# EAGLE design LED_TEST (EAGLE 7.7.0)
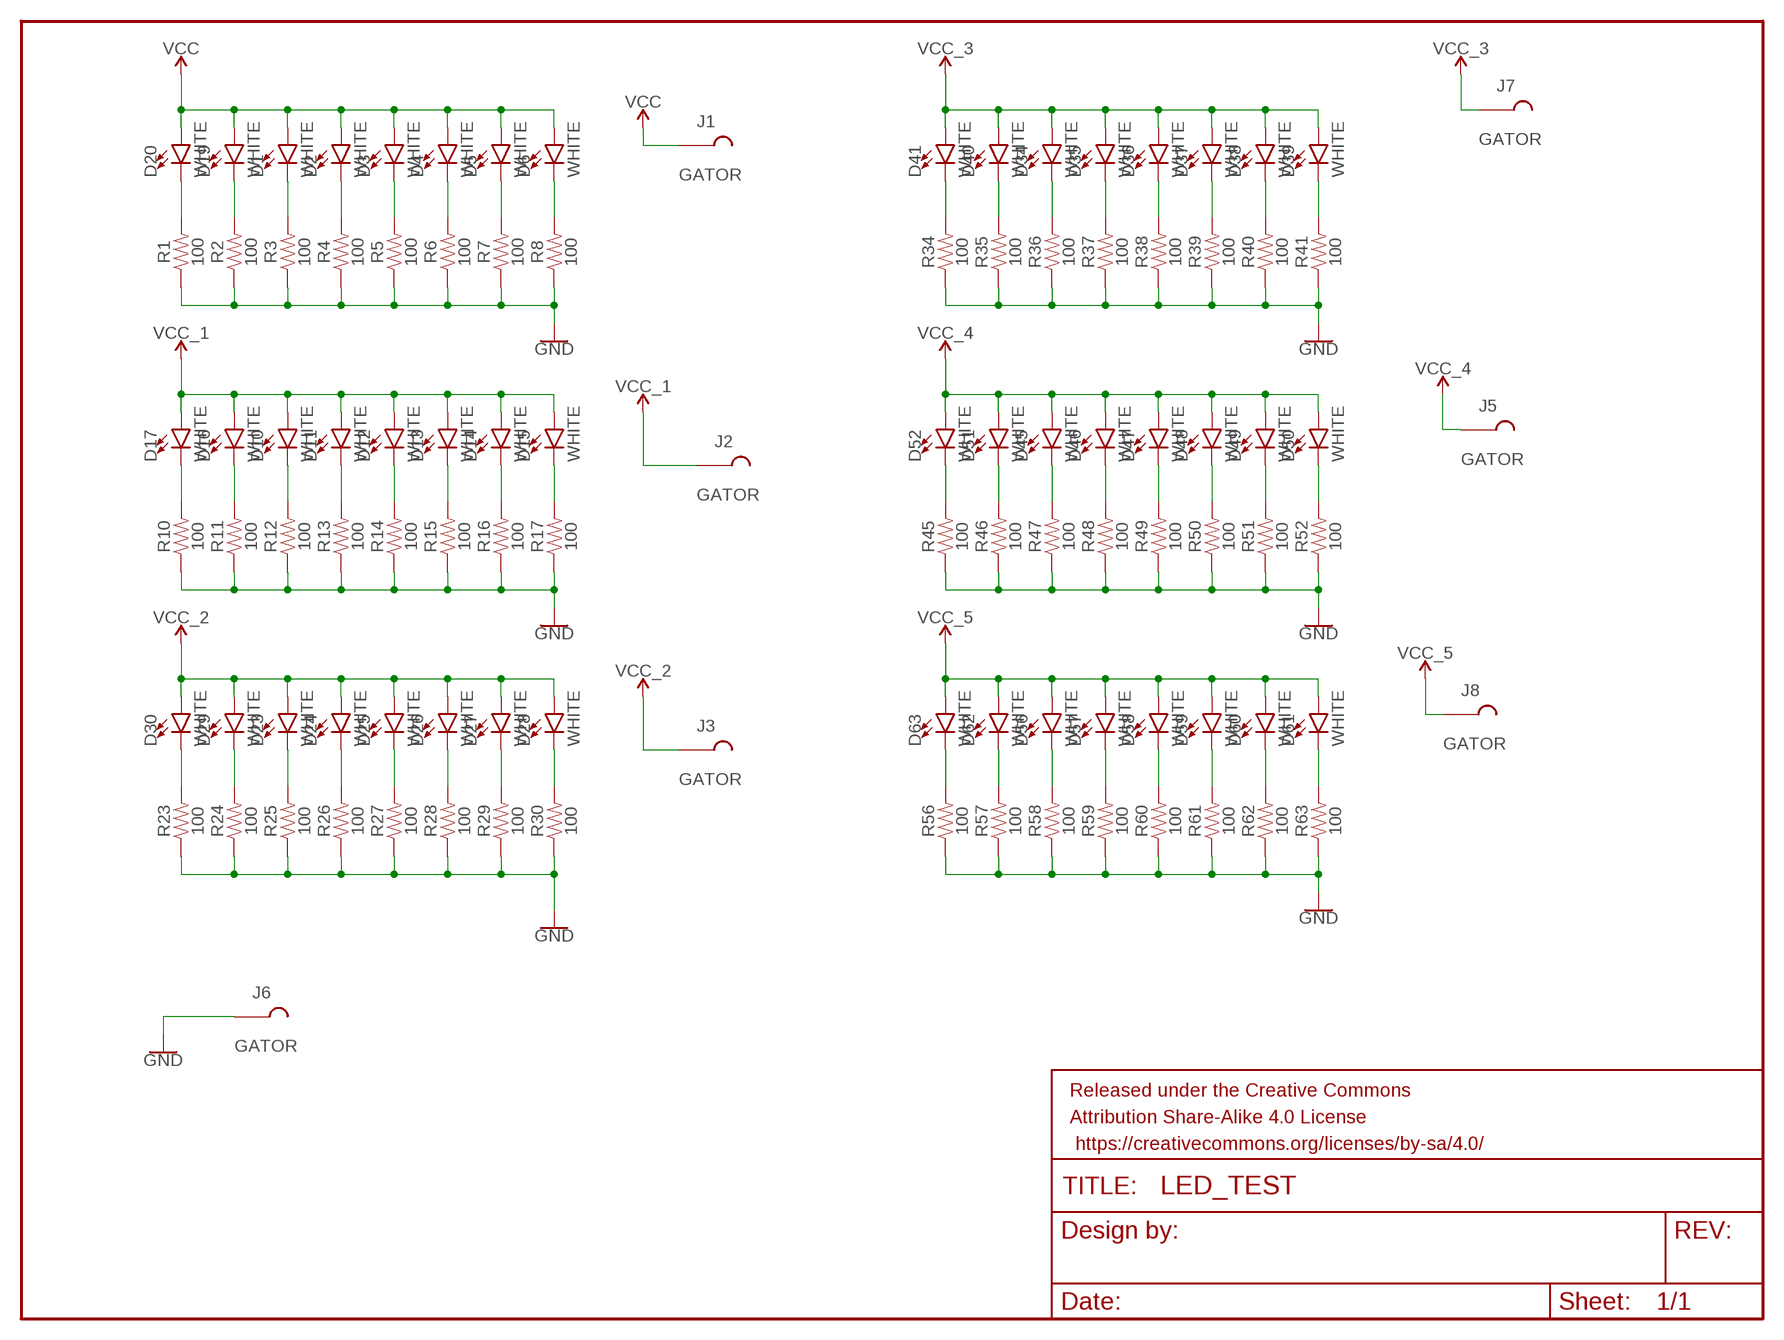
[diagram p0: schematic, sheet 1]

## Parts
D1  WHITE  LED-WHITE1206  [LED-1206]
D2  WHITE  LED-WHITE1206  [LED-1206]
D3  WHITE  LED-WHITE1206  [LED-1206]
D4  WHITE  LED-WHITE1206  [LED-1206]
D5  WHITE  LED-WHITE1206  [LED-1206]
D6  WHITE  LED-WHITE1206  [LED-1206]
D10  WHITE  LED-WHITE1206  [LED-1206]
D11  WHITE  LED-WHITE1206  [LED-1206]
D12  WHITE  LED-WHITE1206  [LED-1206]
D13  WHITE  LED-WHITE1206  [LED-1206]
D14  WHITE  LED-WHITE1206  [LED-1206]
D15  WHITE  LED-WHITE1206  [LED-1206]
D16  WHITE  LED-WHITE1206  [LED-1206]
D17  WHITE  LED-WHITE1206  [LED-1206]
D19  WHITE  LED-WHITE1206  [LED-1206]
D20  WHITE  LED-WHITE1206  [LED-1206]
D23  WHITE  LED-WHITE1206  [LED-1206]
D24  WHITE  LED-WHITE1206  [LED-1206]
D25  WHITE  LED-WHITE1206  [LED-1206]
D26  WHITE  LED-WHITE1206  [LED-1206]
D27  WHITE  LED-WHITE1206  [LED-1206]
D28  WHITE  LED-WHITE1206  [LED-1206]
D29  WHITE  LED-WHITE1206  [LED-1206]
D30  WHITE  LED-WHITE1206  [LED-1206]
D34  WHITE  LED-WHITE1206  [LED-1206]
D35  WHITE  LED-WHITE1206  [LED-1206]
D36  WHITE  LED-WHITE1206  [LED-1206]
D37  WHITE  LED-WHITE1206  [LED-1206]
D38  WHITE  LED-WHITE1206  [LED-1206]
D39  WHITE  LED-WHITE1206  [LED-1206]
D40  WHITE  LED-WHITE1206  [LED-1206]
D41  WHITE  LED-WHITE1206  [LED-1206]
D45  WHITE  LED-WHITE1206  [LED-1206]
D46  WHITE  LED-WHITE1206  [LED-1206]
D47  WHITE  LED-WHITE1206  [LED-1206]
D48  WHITE  LED-WHITE1206  [LED-1206]
D49  WHITE  LED-WHITE1206  [LED-1206]
D50  WHITE  LED-WHITE1206  [LED-1206]
D51  WHITE  LED-WHITE1206  [LED-1206]
D52  WHITE  LED-WHITE1206  [LED-1206]
D56  WHITE  LED-WHITE1206  [LED-1206]
D57  WHITE  LED-WHITE1206  [LED-1206]
D58  WHITE  LED-WHITE1206  [LED-1206]
D59  WHITE  LED-WHITE1206  [LED-1206]
D60  WHITE  LED-WHITE1206  [LED-1206]
D61  WHITE  LED-WHITE1206  [LED-1206]
D62  WHITE  LED-WHITE1206  [LED-1206]
D63  WHITE  LED-WHITE1206  [LED-1206]
FRAME1  FRAME-LETTER  [CREATIVE_COMMONS]
J1  GATOR  [GATOR]
J2  GATOR  [GATOR]
J3  GATOR  [GATOR]
J5  GATOR  [GATOR]
J6  GATOR  [GATOR]
J7  GATOR  [GATOR]
J8  GATOR  [GATOR]
R1  100  100OHM-0603-1/4W-5%  [0603]
R2  100  100OHM-0603-1/4W-5%  [0603]
R3  100  100OHM-0603-1/4W-5%  [0603]
R4  100  100OHM-0603-1/4W-5%  [0603]
R5  100  100OHM-0603-1/4W-5%  [0603]
R6  100  100OHM-0603-1/4W-5%  [0603]
R7  100  100OHM-0603-1/4W-5%  [0603]
R8  100  100OHM-0603-1/4W-5%  [0603]
R10  100  100OHM-0603-1/4W-5%  [0603]
R11  100  100OHM-0603-1/4W-5%  [0603]
R12  100  100OHM-0603-1/4W-5%  [0603]
R13  100  100OHM-0603-1/4W-5%  [0603]
R14  100  100OHM-0603-1/4W-5%  [0603]
R15  100  100OHM-0603-1/4W-5%  [0603]
R16  100  100OHM-0603-1/4W-5%  [0603]
R17  100  100OHM-0603-1/4W-5%  [0603]
R23  100  100OHM-0603-1/4W-5%  [0603]
R24  100  100OHM-0603-1/4W-5%  [0603]
R25  100  100OHM-0603-1/4W-5%  [0603]
R26  100  100OHM-0603-1/4W-5%  [0603]
R27  100  100OHM-0603-1/4W-5%  [0603]
R28  100  100OHM-0603-1/4W-5%  [0603]
R29  100  100OHM-0603-1/4W-5%  [0603]
R30  100  100OHM-0603-1/4W-5%  [0603]
R34  100  100OHM-0603-1/4W-5%  [0603]
R35  100  100OHM-0603-1/4W-5%  [0603]
R36  100  100OHM-0603-1/4W-5%  [0603]
R37  100  100OHM-0603-1/4W-5%  [0603]
R38  100  100OHM-0603-1/4W-5%  [0603]
R39  100  100OHM-0603-1/4W-5%  [0603]
R40  100  100OHM-0603-1/4W-5%  [0603]
R41  100  100OHM-0603-1/4W-5%  [0603]
R45  100  100OHM-0603-1/4W-5%  [0603]
R46  100  100OHM-0603-1/4W-5%  [0603]
R47  100  100OHM-0603-1/4W-5%  [0603]
R48  100  100OHM-0603-1/4W-5%  [0603]
R49  100  100OHM-0603-1/4W-5%  [0603]
R50  100  100OHM-0603-1/4W-5%  [0603]
R51  100  100OHM-0603-1/4W-5%  [0603]
R52  100  100OHM-0603-1/4W-5%  [0603]
R56  100  100OHM-0603-1/4W-5%  [0603]
R57  100  100OHM-0603-1/4W-5%  [0603]
R58  100  100OHM-0603-1/4W-5%  [0603]
R59  100  100OHM-0603-1/4W-5%  [0603]
R60  100  100OHM-0603-1/4W-5%  [0603]
R61  100  100OHM-0603-1/4W-5%  [0603]
R62  100  100OHM-0603-1/4W-5%  [0603]
R63  100  100OHM-0603-1/4W-5%  [0603]

## Nets
GND: J6.P$1 J6.P$2 R1.1 R2.1 R3.1 R4.1 R5.1 R6.1 R7.1 R8.1 R10.1 R11.1 R12.1 R13.1 R14.1 R15.1 R16.1 R17.1 R23.1 R24.1 R25.1 R26.1 R27.1 R28.1 R29.1 R30.1 R34.1 R35.1 R36.1 R37.1 R38.1 R39.1 R40.1 R41.1 R45.1 R46.1 R47.1 R48.1 R49.1 R50.1 R51.1 R52.1 R56.1 R57.1 R58.1 R59.1 R60.1 R61.1 R62.1 R63.1
N$1: D20.C R1.2
N$2: D19.C R2.2
N$3: D1.C R3.2
N$4: D2.C R4.2
N$5: D3.C R5.2
N$6: D4.C R6.2
N$7: D5.C R7.2
N$8: D6.C R8.2
N$9: D17.C R10.2
N$10: D16.C R11.2
N$11: D10.C R12.2
N$12: D11.C R13.2
N$13: D12.C R14.2
N$14: D13.C R15.2
N$15: D14.C R16.2
N$16: D15.C R17.2
N$27: D30.C R23.2
N$28: D29.C R24.2
N$29: D23.C R25.2
N$30: D24.C R26.2
N$31: D25.C R27.2
N$32: D26.C R28.2
N$33: D27.C R29.2
N$34: D28.C R30.2
N$40: D41.C R34.2
N$41: D40.C R35.2
N$42: D34.C R36.2
N$43: D35.C R37.2
N$44: D36.C R38.2
N$45: D37.C R39.2
N$46: D38.C R40.2
N$47: D39.C R41.2
N$53: D52.C R45.2
N$54: D51.C R46.2
N$55: D45.C R47.2
N$56: D46.C R48.2
N$57: D47.C R49.2
N$58: D48.C R50.2
N$59: D49.C R51.2
N$60: D50.C R52.2
N$66: D63.C R56.2
N$67: D62.C R57.2
N$68: D56.C R58.2
N$69: D57.C R59.2
N$70: D58.C R60.2
N$71: D59.C R61.2
N$72: D60.C R62.2
N$73: D61.C R63.2
VCC: D1.A D2.A D3.A D4.A D5.A D6.A D19.A D20.A J1.P$1 J1.P$2
VCC_1: D10.A D11.A D12.A D13.A D14.A D15.A D16.A D17.A J2.P$1 J2.P$2
VCC_2: D23.A D24.A D25.A D26.A D27.A D28.A D29.A D30.A J3.P$1 J3.P$2
VCC_3: D34.A D35.A D36.A D37.A D38.A D39.A D40.A D41.A J7.P$1 J7.P$2
VCC_4: D45.A D46.A D47.A D48.A D49.A D50.A D51.A D52.A J5.P$1 J5.P$2
VCC_5: D56.A D57.A D58.A D59.A D60.A D61.A D62.A D63.A J8.P$1 J8.P$2

## Library data of the parts
D1-D6 D10-D17 D19 D20 D23-D30 D34-D41 D45-D52 D56-D63 = SparkFun-LED:LED-WHITE: White SMD LED Used in manufacturing several products at SparkFun. Packages: 0603 - Bright White SMD 0603 package[Product Link] <http://www.kingbrightusa.com/product.asp?catalog_name=LED&product_id=APT1608QWF/D> 1206 - Bright White SMD1206 package [Product Link] <http://www.kingbrightusa.com/product.asp?catalog_name=LED&product_id=APT3216QWF/D> 3014 - Super Bright SMD 3014 package [Datasheet] <http://www.lumileds.com/uploads/459/DS208-pdf> SparkFun Products: Blackberry Trackballer Breakout <https://www.sparkfun.com/products/13169> Digital SandBox <https://www.sparkfun.com/products/12651>; PROD_ID: DIO-09955
FRAME1 = SparkFun-Aesthetics:FRAME-LETTER: Schematic Frame - Letter Standard 8.5x11 US Letter frame
J1-J3 J5-J8 = TAB:GATOR
R1-R8 R10-R17 R23-R30 R34-R41 R45-R52 R56-R63 = SparkFun-Resistors:100OHM: 100Ω resistor A resistor is a passive two-terminal electrical component that implements electrical resistance as a circuit element. Resistors act to reduce current flow, and, at the same time, act to lower voltage levels within circuits. - Wikipedia; PROD_ID: RES-12438

## Board
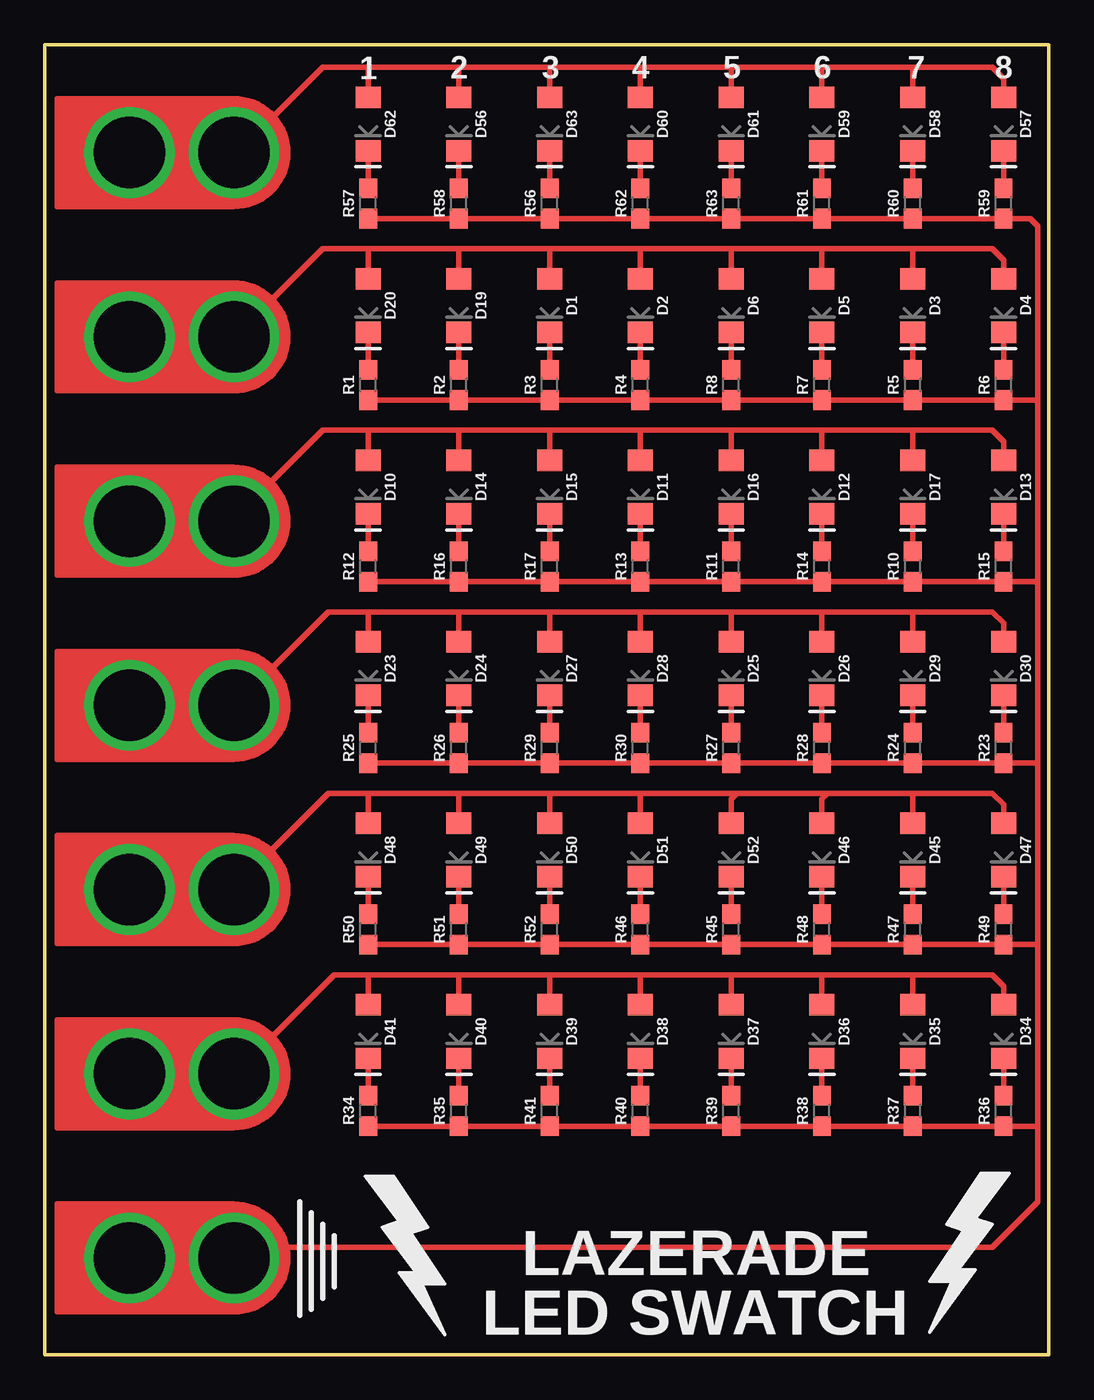
[diagram p1: board, top side]
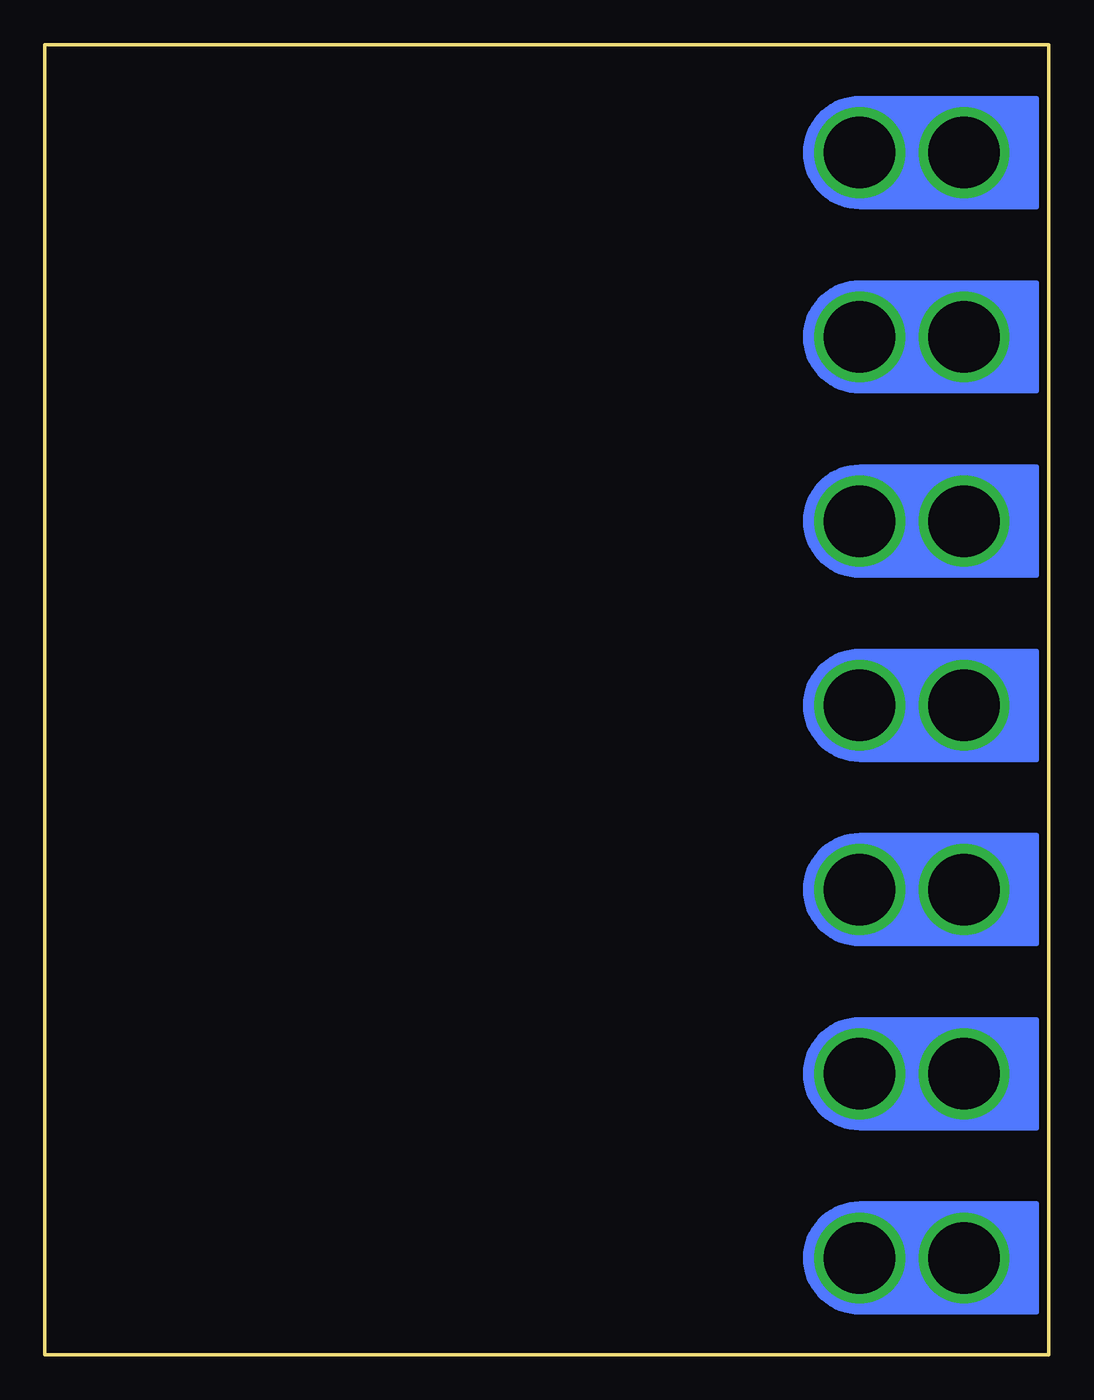
[diagram p2: board, bottom side, seen from below]

Size 56.2 x 73.34 mm. Coordinates in mm from the lower left corner, seen from the top.
Outline: 0,73.34 56.2,73.34 56.2,0 0,0 0,73.34
Copper layers (1*16): Top 0.035mm / dielectric 1.5mm / Bottom 0.035mm
Design rules "SparkFun-2-layer-STANDARD": minimum track width 10mil, minimum drill 20mil, track to track 10mil, track to pad 8mil, pad to pad 8mil, via to via 10mil, smd to smd 8mil, copper to edge 8mil, drill to drill 8mil, minimum pad ring 10mil, minimum via ring 10mil, stop-mask expansion 4mil, vias tented up to drill 25mil, thermal gap 10mil

### Footprints (pad centres in the part's own frame; a part is rotated, then mirrored left to right if it is on the bottom)
LED-1206 = smd 1.2 x 1.4: A -1.5,0; C 1.5,0
GATOR = drill 4 pad 5.08: P$1 0,-6.096; P$2 0,-0.254
0603 = smd 1.1 x 1: 1 -0.85,0; 2 0.85,0

### Placement (x,y rotation side)
D1  28.26,58.74 270 top
D2  33.34,58.74 270 top
D3  48.58,58.74 270 top
D4  53.66,58.74 270 top
D5  43.5,58.74 270 top
D6  38.42,58.74 270 top
D10  18.1,48.58 270 top
D11  33.34,48.58 270 top
D12  43.5,48.58 270 top
D13  53.66,48.58 270 top
D14  23.18,48.58 270 top
D15  28.26,48.58 270 top
D16  38.42,48.58 270 top
D17  48.58,48.58 270 top
D19  23.18,58.74 270 top
D20  18.1,58.74 270 top
D23  18.1,38.42 270 top
D24  23.18,38.42 270 top
D25  38.42,38.42 270 top
D26  43.5,38.42 270 top
D27  28.26,38.42 270 top
D28  33.34,38.42 270 top
D29  48.58,38.42 270 top
D30  53.66,38.42 270 top
D34  53.66,18.1 270 top
D35  48.58,18.1 270 top
D36  43.5,18.1 270 top
D37  38.42,18.1 270 top
D38  33.34,18.1 270 top
D39  28.26,18.1 270 top
D40  23.18,18.1 270 top
D41  18.1,18.1 270 top
D45  48.58,28.26 270 top
D46  43.5,28.26 270 top
D47  53.66,28.26 270 top
D48  18.1,28.26 270 top
D49  23.18,28.26 270 top
D50  28.26,28.26 270 top
D51  33.34,28.26 270 top
D52  38.42,28.26 270 top
D56  23.18,68.9 270 top
D57  53.66,68.9 270 top
D58  48.58,68.9 270 top
D59  43.5,68.9 270 top
D60  33.34,68.9 270 top
D61  38.42,68.9 270 top
D62  18.1,68.9 270 top
D63  28.26,68.9 270 top
FRAME1  -14.29,-10.16 0 top  (outside the outline)
J1  10.85,56.98 270 top
J2  10.85,46.67 270 top
J3  10.85,36.36 270 top
J5  10.85,26.05 270 top
J6  10.85,5.42 270 top
J7  10.85,15.74 270 top
J8  10.85,67.3 270 top
R1  18.1,54.29 90 top
R2  23.18,54.29 90 top
R3  28.26,54.29 90 top
R4  33.34,54.29 90 top
R5  48.58,54.29 90 top
R6  53.66,54.29 90 top
R7  43.5,54.29 90 top
R8  38.42,54.29 90 top
R10  48.58,44.13 90 top
R11  38.42,44.13 90 top
R12  18.1,44.13 90 top
R13  33.34,44.13 90 top
R14  43.5,44.13 90 top
R15  53.66,44.13 90 top
R16  23.18,44.13 90 top
R17  28.26,44.13 90 top
R23  53.66,33.97 90 top
R24  48.58,33.97 90 top
R25  18.1,33.97 90 top
R26  23.18,33.97 90 top
R27  38.42,33.97 90 top
R28  43.5,33.97 90 top
R29  28.26,33.97 90 top
R30  33.34,33.97 90 top
R34  18.1,13.65 90 top
R35  23.18,13.65 90 top
R36  53.66,13.65 90 top
R37  48.58,13.65 90 top
R38  43.5,13.65 90 top
R39  38.42,13.65 90 top
R40  33.34,13.65 90 top
R41  28.26,13.65 90 top
R45  38.42,23.81 90 top
R46  33.34,23.81 90 top
R47  48.58,23.81 90 top
R48  43.5,23.81 90 top
R49  53.66,23.81 90 top
R50  18.1,23.81 90 top
R51  23.18,23.81 90 top
R52  28.26,23.81 90 top
R56  28.26,64.45 90 top
R57  18.1,64.45 90 top
R58  23.18,64.45 90 top
R59  53.66,64.45 90 top
R60  48.58,64.45 90 top
R61  43.5,64.45 90 top
R62  33.34,64.45 90 top
R63  38.42,64.45 90 top

### Tracks (layer width: path | path; a pad name or v marks a point on that pad's centre or on a via)
GND
  Top 0.305: R57.1 R58.1 R56.1 R62.1 R63.1 R61.1 R60.1 R59.1 55.14,63.6 55.56,63.18 55.56,53.34 | 55.56,53.34 55.56,43.18 | 55.56,43.18 55.56,33.02 | 55.56,33.02 55.56,22.86 | 55.56,22.86 55.56,12.7 | 55.56,12.7 55.56,8.57 53.02,6.03 12.07,6.03 10.79,4.76 10.79,5.22 J6.P$2 10.57,5.4 10.16,5.4 10.13,5.42 J6.P$1 | 55.56,53.34 55.46,53.44 R6.1 R5.1 R7.1 R8.1 R4.1 R3.1 R2.1 R1.1 | R12.1 R16.1 R17.1 R13.1 R11.1 R14.1 R10.1 R15.1 55.46,43.28 55.56,43.18 | R25.1 R26.1 R29.1 R30.1 R27.1 R28.1 R24.1 R23.1 55.46,33.12 55.56,33.02 | R50.1 R51.1 R52.1 R46.1 R45.1 R48.1 R47.1 R49.1 55.46,22.96 55.56,22.86 | R34.1 R35.1 R41.1 R40.1 R39.1 R38.1 R37.1 R36.1 55.46,12.8 55.56,12.7
N$1
  Top 0.305: D20.C R1.2
N$2
  Top 0.305: D19.C R2.2
N$3
  Top 0.305: D1.C R3.2
N$4
  Top 0.305: D2.C R4.2
N$5
  Top 0.305: D3.C R5.2
N$6
  Top 0.305: D4.C R6.2
N$7
  Top 0.305: D5.C R7.2
N$8
  Top 0.305: D6.C R8.2
N$9
  Top 0.305: D17.C R10.2
N$10
  Top 0.305: D16.C R11.2
N$11
  Top 0.305: D10.C R12.2
N$12
  Top 0.305: D11.C R13.2
N$13
  Top 0.305: D12.C R14.2
N$14
  Top 0.305: D13.C R15.2
N$15
  Top 0.305: D14.C R16.2
N$16
  Top 0.305: D15.C R17.2
N$27
  Top 0.305: D30.C R23.2
N$28
  Top 0.305: D29.C R24.2
N$29
  Top 0.305: D23.C R25.2
N$30
  Top 0.305: D24.C R26.2
N$31
  Top 0.305: D25.C R27.2
N$32
  Top 0.305: D26.C R28.2
N$33
  Top 0.305: D27.C R29.2
N$34
  Top 0.305: D28.C R30.2
N$40
  Top 0.305: D41.C R34.2
N$41
  Top 0.305: D40.C R35.2
N$42
  Top 0.305: D34.C R36.2
N$43
  Top 0.305: D35.C R37.2
N$44
  Top 0.305: D36.C R38.2
N$45
  Top 0.305: D37.C R39.2
N$46
  Top 0.305: D38.C R40.2
N$47
  Top 0.305: D39.C R41.2
N$53
  Top 0.305: D52.C R45.2
N$54
  Top 0.305: D51.C R46.2
N$55
  Top 0.305: D45.C R47.2
N$56
  Top 0.305: D46.C R48.2
N$57
  Top 0.305: D47.C R49.2
N$58
  Top 0.305: D48.C R50.2
N$59
  Top 0.305: D49.C R51.2
N$60
  Top 0.305: D50.C R52.2
N$66
  Top 0.305: D63.C R56.2
N$67
  Top 0.305: D62.C R57.2
N$68
  Top 0.305: D56.C R58.2
N$69
  Top 0.305: D57.C R59.2
N$70
  Top 0.305: D58.C R60.2
N$71
  Top 0.305: D59.C R61.2
N$72
  Top 0.305: D60.C R62.2
N$73
  Top 0.305: D61.C R63.2
VCC
  Top 0.305: J1.P$1 J1.P$2 10.63,56.98 15.56,61.91 18.1,61.91 | 18.1,61.91 23.18,61.91 | 23.18,61.91 28.26,61.91 | 28.26,61.91 33.34,61.91 | 33.34,61.91 38.42,61.91 | 38.42,61.91 43.5,61.91 | 43.5,61.91 48.58,61.91 | 48.58,61.91 53.02,61.91 53.66,61.28 D4.A | D3.A 48.58,61.91 | D5.A 43.5,61.91 | D6.A 38.42,61.91 | D2.A 33.34,61.91 | D1.A 28.26,61.91 | D20.A 18.1,61.91 | D19.A 23.18,61.91
VCC_1
  Top 0.305: J2.P$1 J2.P$2 10.59,46.79 15.56,51.75 18.1,51.75 | 18.1,51.75 23.18,51.75 | 23.18,51.75 28.26,51.75 | 28.26,51.75 33.34,51.75 | 33.34,51.75 38.42,51.75 | 38.42,51.75 43.5,51.75 | 43.5,51.75 48.58,51.75 | 48.58,51.75 53.02,51.75 53.66,51.12 D13.A | D17.A 48.58,51.75 | D12.A 43.5,51.75 | D16.A 38.42,51.75 | D11.A 33.34,51.75 | D15.A 28.26,51.75 | D14.A 23.18,51.75 | D10.A 18.1,51.75
VCC_2
  Top 0.305: J3.P$1 J3.P$2 10.64,36.36 15.87,41.59 18.1,41.59 | 18.1,41.59 23.18,41.59 | 23.18,41.59 28.26,41.59 | 28.26,41.59 33.34,41.59 | 33.34,41.59 38.42,41.59 | 38.42,41.59 43.5,41.59 | 43.5,41.59 48.58,41.59 | 48.58,41.59 53.02,41.59 53.66,40.96 D30.A | D29.A 48.58,41.59 | D26.A 43.5,41.59 | D25.A 38.42,41.59 | D28.A 33.34,41.59 | D27.A 28.26,41.59 | D24.A 23.18,41.59 | D23.A 18.1,41.59
VCC_3
  Top 0.305: J7.P$1 J7.P$2 10.66,15.74 16.19,21.27 18.1,21.27 | 18.1,21.27 23.18,21.27 | 23.18,21.27 28.26,21.27 | 28.26,21.27 33.34,21.27 | 33.34,21.27 38.42,21.27 | 38.42,21.27 43.5,21.27 | 43.5,21.27 48.58,21.27 | 48.58,21.27 53.02,21.27 53.66,20.64 D34.A | D35.A 48.58,21.27 | D36.A 43.5,21.27 | D37.A 38.42,21.27 | D38.A 33.34,21.27 | D39.A 28.26,21.27 | D40.A 23.18,21.27 | D41.A 18.1,21.27
VCC_4
  Top 0.305: J5.P$1 J5.P$2 10.59,26.15 15.87,31.43 18.1,31.43 | 18.1,31.43 23.18,31.43 | 23.18,31.43 28.26,31.43 | 28.26,31.43 33.34,31.43 | 33.34,31.43 38.73,31.43 | 38.73,31.43 43.82,31.43 | 43.82,31.43 48.58,31.43 | 48.58,31.43 53.02,31.43 53.66,30.8 D47.A | D45.A 48.58,31.43 | D46.A 43.5,31.12 43.82,31.43 | D52.A 38.42,31.12 38.73,31.43 | D51.A 33.34,31.43 | D50.A 28.26,31.43 | D49.A 23.18,31.43 | D48.A 18.1,31.43
VCC_5
  Top 0.305: J8.P$1 J8.P$2 10.78,67.3 15.56,72.07 18.1,72.07 | 18.1,72.07 23.18,72.07 | 23.18,72.07 28.26,72.07 | 28.26,72.07 33.34,72.07 | 33.34,72.07 38.42,72.07 | 38.42,72.07 43.5,72.07 | 43.5,72.07 48.58,72.07 | 48.58,72.07 53.02,72.07 53.66,71.44 D57.A | D58.A 48.58,72.07 | D59.A 43.5,72.07 | D61.A 38.42,72.07 | D60.A 33.34,72.07 | D63.A 28.26,72.07 | D56.A 23.18,72.07 | D62.A 18.1,72.07

### Text on the board
tPlace: 1 | 2 | 3 | 4 | 5 | 6 | 7 | 8 | LAZERADE | LED SWATCH
tDocu: Mary "LightningHawk" West